# EAGLE design Zx81CompositeSMD (EAGLE 9.6.1)
ZX81 Composite modification With adjustable Black Level and Line Sync Done by Thanat0s - 2020 WTFPL Licence
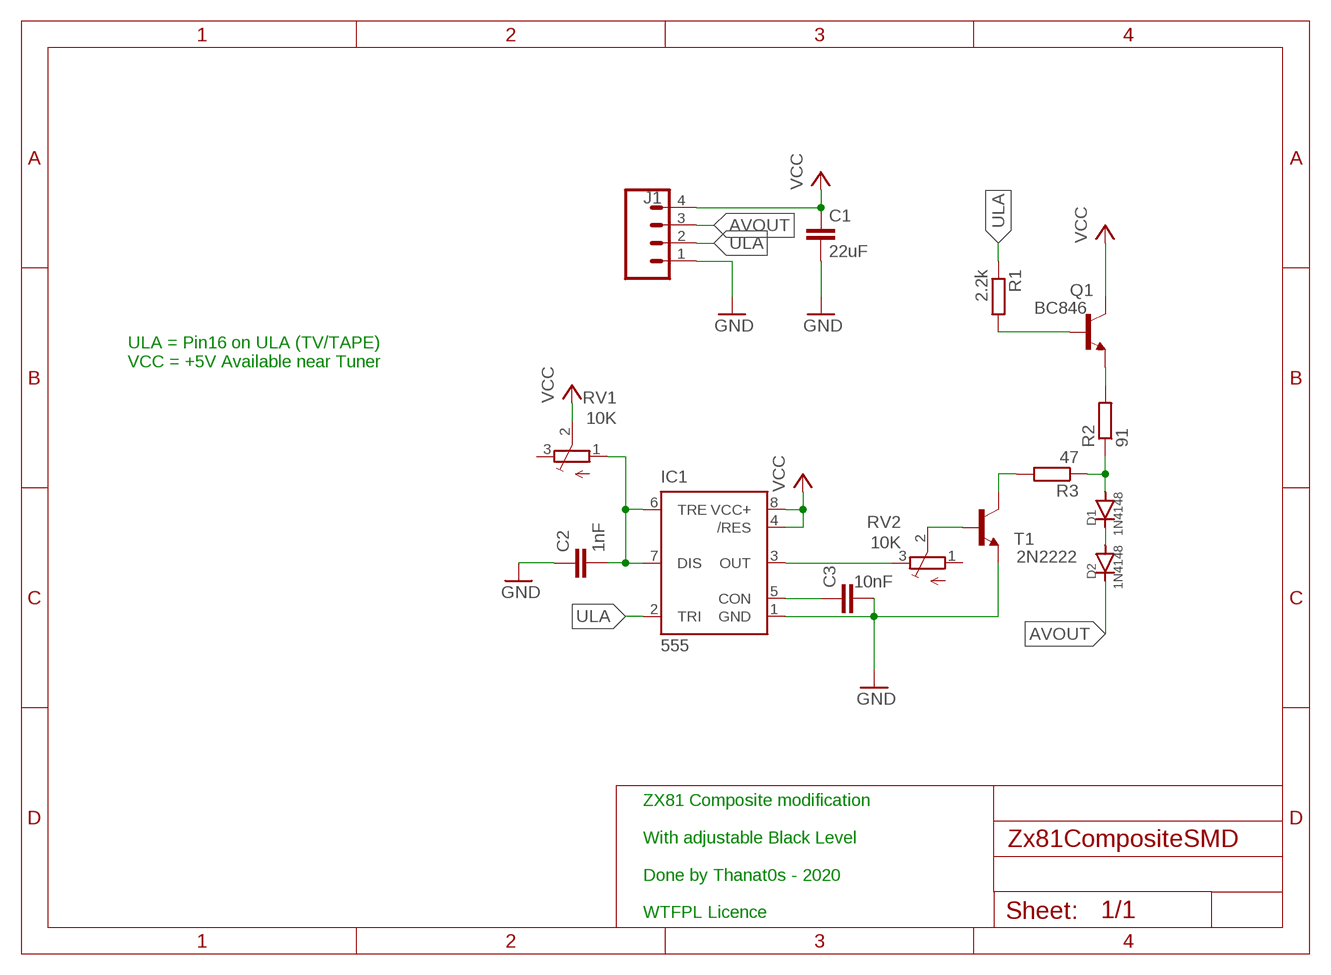
[diagram p0: schematic, sheet 1]

## Parts
C1  22uF  C-EUC1206K  [C1206K]
C2  1nF  C-EUC0603K  [C0603K]
C3  10nF  C-EUC0603K  [C0603K]
D1  1N4148  1N4148WS  [SOD-323]
D2  1N4148  1N4148WS  [SOD-323]
IC1  555  555D  [SO08]
J1  CONN_04  [1X04]
Q1  BC846  [SOT23]
R1  2.2k  R-EU_R0603  [R0603]
R2  91  R-EU_R0603  [R0603]
R3  47  R-EU_R0603  [R0603]
RV1  10K  TRIM_EU-SM-42/43A  [SM-42/43A]
RV2  10K  TRIM_EU-SM-42/43A  [SM-42/43A]
T1  2N2222  BC850  [SOT23]

## Nets
AVOUT: D2.C J1.3
GND: C1.2 C2.1 C3.2 IC1.1(GND) J1.1 T1.2(E)
N$1: Q1.1(B) R1.2
N$2: D1.C D2.A
N$3: RV2.2(S) T1.1(B)
N$4: C3.1 IC1.5(CON)
N$5: C2.2 IC1.6(TRE) IC1.7(DIS) RV1.1(A)
N$6: IC1.3(OUT) RV2.3(E)
N$7: D1.A R2.1 R3.1
N$8: R3.2 T1.3(C)
N$11: Q1.2(E) R2.2
ULA: IC1.2(TRI) J1.2 R1.1
VCC: C1.1 IC1.4(/RES) IC1.8(VCC+) J1.4 Q1.3(C) RV1.2(S)
Unconnected: RV1.3(E) RV2.1(A)

## Notes on the sheet
- ULA = Pin16 on ULA (TV/TAPE)
  VCC = +5V Available near Tuner
- ZX81 Composite modification
  
  With adjustable Black Level
  
  Done by Thanat0s - 2020
  
  WTFPL Licence

## Library data of the parts
C1-C3 = rcl:C-EU: CAPACITOR, European symbol; SPICEPREFIX: C
D1 D2 = Diodes:1N4148WS: DIODE GEN PURP 75V 150MA SOD323F Manufacturer's datasheet <https://www.onsemi.com/pub/Collateral/1N914BWS-D.pdf>; CREATED_BY: PCBLayout.com; DIGIKEY_PART_NUMBER: 1N4148WSFSTR-ND; MANUFACTURER: Diodes Incorporated; MPN: 1N4148WS; PACKAGE: SOD-323
IC1 = SparkFun-IC-Special-Function:555: General purpose bipolar Timer Datasheet <http://www.sparkfun.com/datasheets/Components/General/ne555.pdf> SparkFun Products SparkFun SparkPunk Sequencer Kit <https://www.sparkfun.com/products/12707> (KIT-12707) Storefront Component: 555 Timer <https://www.sparkfun.com/products/9273> (COM-09273) Two parts valid for production: VFP: IC-11930 (M7555 PTH) VFP: IC-09173 (555 PTH) - Preferred; PROD_ID: NA-XXXXX
J1 = SparkFun-Connectors:CONN_04: Multi connection point. Often used as Generic Header-pin footprint for 0.1 inch spaced/style header connections On any of the 0.1 inch spaced packages, you can populate with these: Break Away Headers - Straight <https://www.sparkfun.com/products/116> (PRT-00116) Break Away Male Headers - Right Angle <https://www.sparkfun.com/products/553> (PRT-00553) Female Headers <https://www.sparkfun.com/products/115> (PRT-00115) Break Away Headers - Machine Pin <https://www.sparkfun.com/products/117> (PRT-00117) Break Away Female Headers - Swiss Machine Pin <https://www.sparkfun.com/products/743> (PRT-00743) For SCREWTERMINALS and SPRING TERMINALS visit here: Screw Terimnals on SparkFun.com <https://www.sparkfun.com/search/results?term=Screw+Terminals> (5mm/3.5mm/2.54mm spacing) This device is also useful as a general connection point to wire up your design to another part of your project. Our various solder wires solder well into these plated through hole pads. Hook-Up Wire - Assortment (Stranded, 22 AWG) <https://www.sparkfun.com/products/11375> (PRT-11375) Hook-Up Wire - Assortment (Solid Core, 22 AWG) <https://www.sparkfun.com/products/11367> (PRT-11367) View the entire wire category on our website here <https://www.sparkfun.com/categories/141> Special notes: Molex polarized connector foot print use with SKU : PRT-08231 with associated crimp pins and housings. 1MM SMD Version SKU: PRT-10208; PROD_ID: CONN-09696
Q1 = transistor:BC846: NPN TRANSISTOR
R1-R3 = rcl:R-EU_: RESISTOR, European symbol; SPICEPREFIX: R
RV1 RV2 = pot:TRIM_EU-: POTENTIOMETER; SPICEPREFIX: J
T1 = transistor:BC850: NPN TRANSISTOR; SPICEPREFIX: J

## Net classes
0 default: width 0.15 mm

## Board
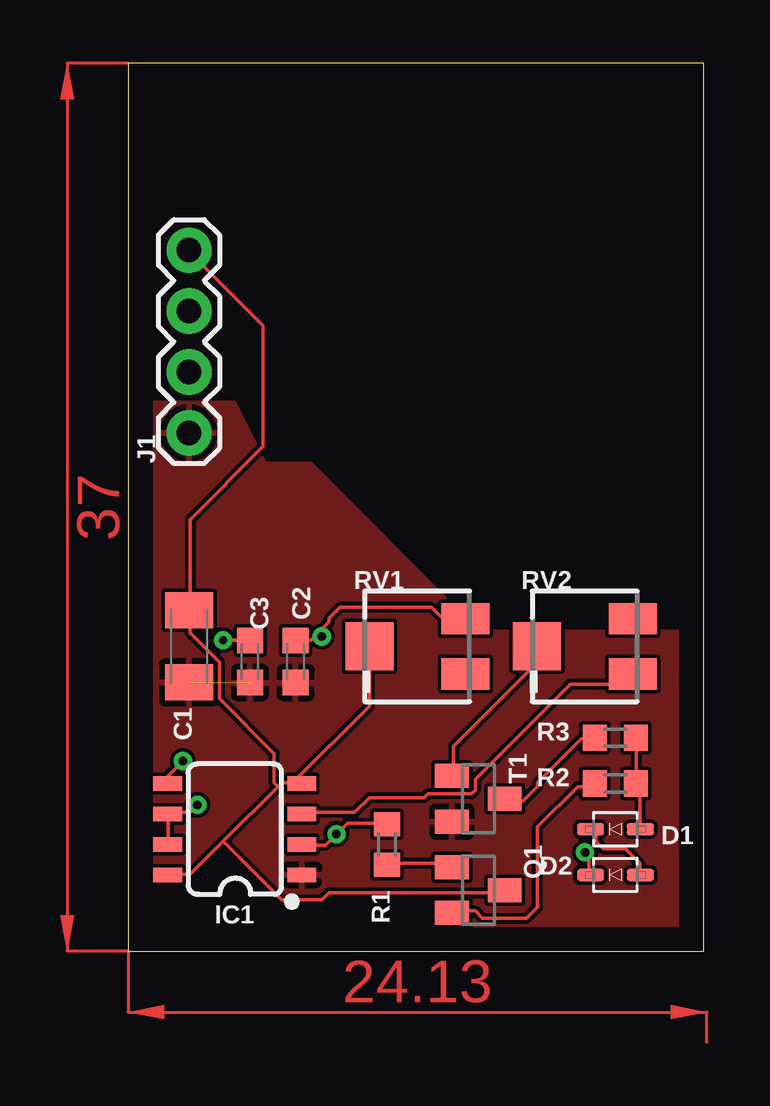
[diagram p1: board, top side]
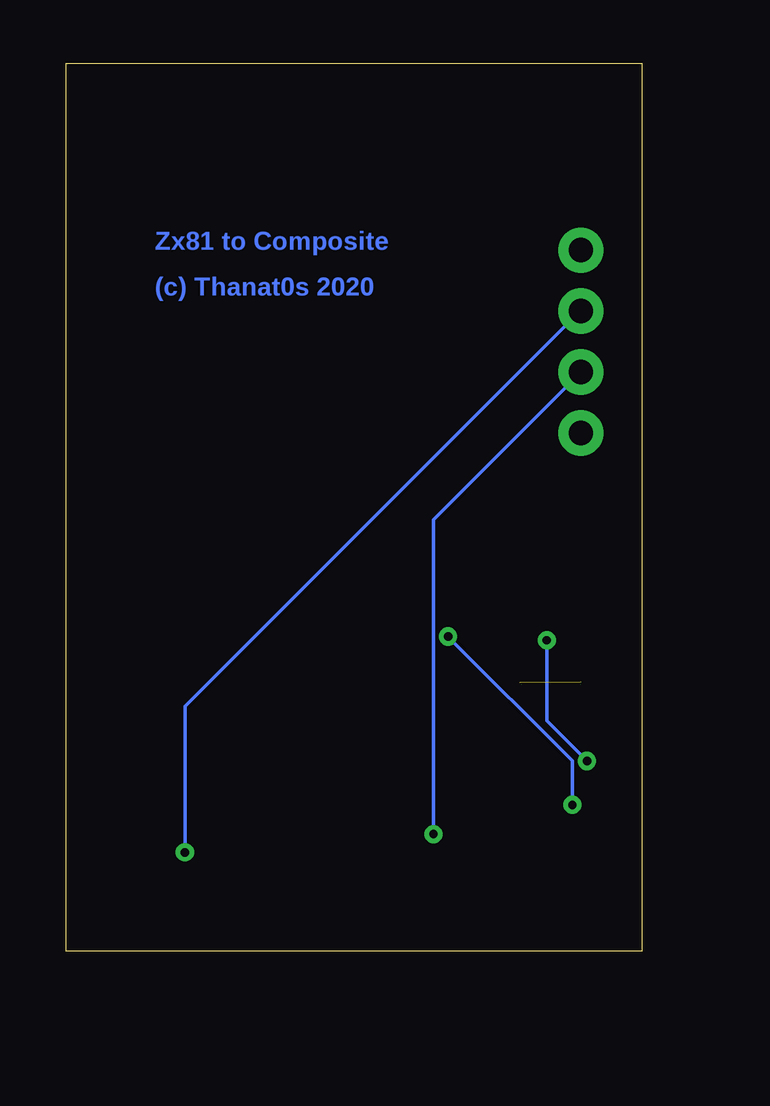
[diagram p2: board, bottom side, seen from below]

Size 24 x 37 mm. Coordinates in mm from the lower left corner, seen from the top.
Outline: 0,0 24,0 24,37 0,37 0,0
Copper layers (1*16): Top 0.035mm / dielectric 1.5mm / Bottom 0.035mm
Design rules "typon": minimum track width 6mil, minimum drill 0.35mm, track to track 6mil, track to pad 6mil, pad to pad 6mil, via to via 6mil, smd to smd 6mil, copper to edge 40mil, drill to drill 6mil, minimum pad ring 10mil, minimum via ring 8mil, stop-mask expansion 4mil, vias tented up to drill 0mil, thermal gap 10mil

### Footprints (pad centres in the part's own frame; a part is rotated, then mirrored left to right if it is on the bottom)
C1206K = smd 1.5 x 2: 1 -1.5,0; 2 1.5,0
C0603K = smd 1.05 x 1.08: 1 -0.875,0; 2 0.875,0
SOD-323 = smd 1.14 x 0.52: A 1.04,0; C -1.04,0
SO08 = smd 0.6 x 1.2: 1 -1.905,-2.8; 2 -0.635,-2.8; 3 0.635,-2.8; 4 1.905,-2.8; 5 1.905,2.8; 6 0.635,2.8; 7 -0.635,2.8; 8 -1.905,2.8
1X04 = drill 1.016 pad 1.88: 1 0,0; 2 2.54,0; 3 5.08,0; 4 7.62,0
SOT23 = smd 1 x 1.4: 1 -0.95,-1.1; 2 0.95,-1.1; 3 0,1.1
R0603 = smd 1 x 1.1: 1 -0.85,0; 2 0.85,0
SM-42/43A = smd 2 x 1.3: 1 2,1.15; 3 2,-1.15 | smd 2 x 2: 2 -2,0

### Placement (x,y rotation side)
C1  2.54,12.7 270 top
C2  6.99,12.06 90 top
C3  5.08,12.06 270 top
D1  20.32,5.08 0 top
D2  20.32,3.17 0 top
IC1  4.45,5.08 90 top
J1  2.54,21.59 90 top
Q1  14.61,2.54 270 top
R1  10.79,4.45 270 top
R2  20.32,6.99 180 top
R3  20.32,8.89 180 top
RV1  12.06,12.7 0 top
RV2  19.05,12.7 0 top
T1  14.61,6.35 270 top

### Tracks (layer width: path | path; a pad name or v marks a point on that pad's centre or on a via)
AVOUT  (via drill 0.35)
  Top 0.152: v19.05,4.12 19.2,3.96 19.2,3.2 D2.C
  Bottom 0.152: v19.05,4.12 19.05,10.21 2.59,26.67 J1.3
GND  (1 unrouted)
  pour Top: 0,22.86 4.45,22.86 5.71,20.32 7.62,20.32 13.97,13.97 14.61,13.34 24.13,13.34 24.13,0 0,0
N$1
  Top 0.152: R1.2 10.82,3.66 13.26,3.66 13.41,3.5 Q1.1
N$2
  Top 0.152: D2.A 21.34,3.2 21.34,3.66 20.73,4.27 19.81,4.27 19.51,4.57 19.51,5.03 19.36,5.18 D1.C
N$3
  Top 0.152: T1.1 13.56,7.32 13.56,8.53 16.92,11.89 16.92,12.65 RV2.2
N$4  (via drill 0.35)
  Top 0.152: v3.96,12.95 5.03,12.95 C3.1 | v2.29,7.92 1.68,7.32 1.68,7.01 IC1.5
  Bottom 0.152: v3.96,12.95 3.96,9.6 v2.29,7.92
N$5  (via drill 0.35)
  Top 0.152: IC1.7 1.68,4.57 1.68,5.64 IC1.6 1.68,5.79 2.59,5.79 v2.9,6.1 | 7.92,13.26 8.38,13.72 8.38,13.87 8.84,14.33 12.65,14.33 13.11,13.87 14.02,13.87 RV1.1 | 7.92,13.26 7.62,12.95 7.01,12.95 C2.2 | 7.92,13.26 v8.08,13.11
  Bottom 0.152: v2.9,6.1 2.9,7.92 v8.08,13.11
N$6
  Top 0.152: IC1.3 7.32,5.79 9.45,5.79 10.06,6.4 12.34,6.4 12.5,6.55 14.33,6.55 14.48,6.71 14.48,7.16 18.44,11.12 20.73,11.12 21.03,11.43 RV2.3
N$7
  Top 0.152: R3.1 21.18,8.84 21.18,7.01 R2.1 21.18,6.86 21.34,6.71 21.34,5.18 D1.A
N$8
  Top 0.152: R3.2 19.36,8.84 18.9,8.84 17.07,7.01 17.07,6.86 16.46,6.25 15.85,6.25 T1.3
N$11
  Top 0.152: R2.2 19.36,6.86 18.75,6.86 17.07,5.18 17.07,1.83 16.61,1.37 14.78,1.37 14.48,1.68 13.56,1.68 Q1.2
ULA  (via drill 0.35)
  Top 0.152: R1.1 10.67,5.33 9.14,5.33 v8.69,4.88 8.23,4.42 7.32,4.42 IC1.2
  Bottom 0.152: v8.69,4.88 8.69,17.98 J1.2
VCC
  Top 0.152: J1.4 2.59,29.11 5.64,26.06 5.64,21.03 2.59,17.98 2.59,14.33 C1.1 2.59,14.17 2.59,13.26 3.81,12.04 3.81,10.52 6.1,8.23 6.1,7.01 6.25,6.86 | 6.25,6.86 6.4,7.01 6.86,7.01 | 6.25,6.86 3.96,4.57 | 3.96,4.57 2.59,3.2 1.68,3.2 IC1.8 | 6.86,7.01 7.16,7.01 IC1.4 6.86,7.01 | 3.96,4.57 6.4,2.13 8.08,2.13 8.38,2.44 15.7,2.44 Q1.3 | 6.86,7.01 10.06,10.21 10.06,12.65 RV1.2
(copper drawn outside any net)
  shapes: Top area x2

### Text on the board
Bottom: Zx81 to Composite | (c) Thanat0s 2020